# Altium schematic sheet Sensors.SchDoc
size A; SheetNumber: 3; SheetTotal: 3
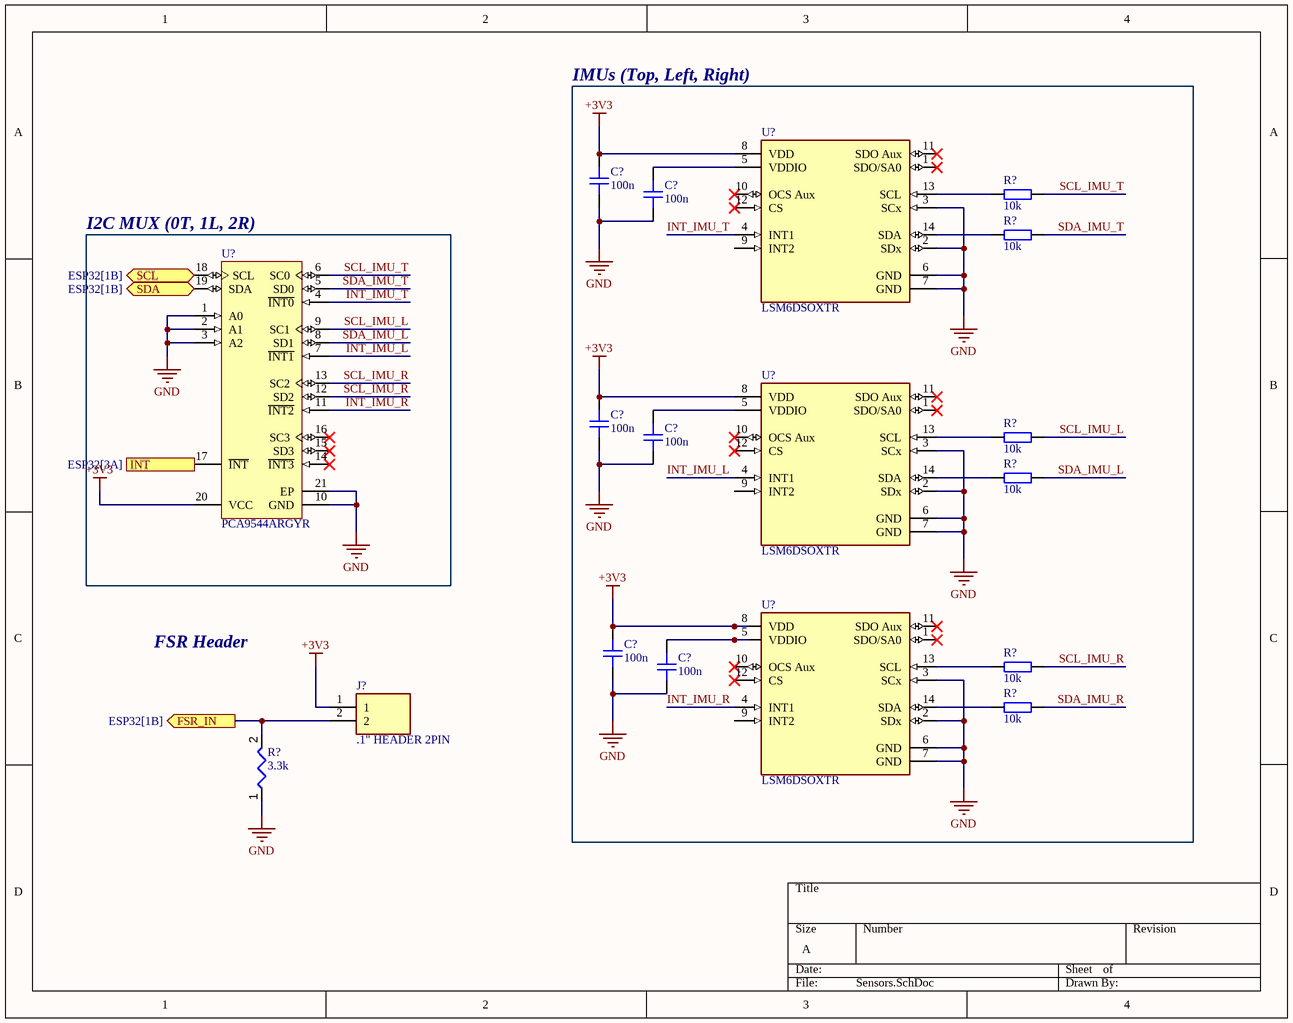
[diagram p0: Sensors.SchDoc]

## Parts
(Parts that share a designator on the sheet are numbered #1, #2 ... from top to bottom, then left to right.)
C?#1  100n  [CAP_0603]
C?#2  100n  [CAP_0603]
C?#3  100n  [CAP_0603]
C?#4  100n  [CAP_0603]
C?#5  100n  [CAP_0603]
C?#6  100n  [CAP_0603]
J?  .1" HEADER 2PIN  [HDRV2W64P0X254_1X2_508X250X850P]  (no BOM)
R?#1  10k  [RES_0603]
R?#2  10k  [RES_0603]
R?#3  10k  [RES_0603]
R?#4  10k  [RES_0603]
R?#5  10k  [RES_0603]
R?#6  10k  [RES_0603]
R?#7  value 3.3k  [RES_0603]  (hidden comment: RES 3.3k)
U?#1  LSM6DSOXTR  [FP-LGA-14L-DM00249496-MFG]
U?#2  PCA9544ARGYR  [RGY0020A_V]
U?#3  LSM6DSOXTR  [FP-LGA-14L-DM00249496-MFG]
U?#4  LSM6DSOXTR  [FP-LGA-14L-DM00249496-MFG]

## Blocks framed on the sheet
IMUs (Top, Left, Right): C?#1-C?#6 R?#1-R?#6 U?#1 U?#3 U?#4
I2C MUX (0T, 1L, 2R): U?#2

## Ports
FSR_IN (out, see ESP32[1B]), INT (out, see ESP32[3A]), SCL (bidir, see ESP32[1B]), SDA (bidir, see ESP32[1B])

## Nets
+3V3: C?#1.2 C?#3.2 C?#5.2 J?.1 U?#1.8(VDD) U?#2.20(VCC) U?#3.8(VDD) U?#4.8(VDD)
GND: C?#1.1 C?#2.1 C?#3.1 C?#4.1 C?#5.1 C?#6.1 R?#7.1 U?#1.2(SDx) U?#1.3(SCx) U?#1.6(GND) U?#1.7(GND) U?#2.1(A0) U?#2.2(A1) U?#2.3(A2) U?#2.10(GND) U?#2.21(EP) U?#3.2(SDx) U?#3.3(SCx) U?#3.6(GND) U?#3.7(GND) U?#4.2(SDx) U?#4.3(SCx) U?#4.6(GND) U?#4.7(GND)
FSR_IN: J?.2 R?#7.2 ; port FSR_IN
INT: U?#2.17(~{INT}) ; port INT
INT_IMU_L: U?#2.7(~{INT1}) U?#3.4(INT1)
INT_IMU_R: U?#2.11(~{INT2}) U?#4.4(INT1)
INT_IMU_T: U?#1.4(INT1) U?#2.4(~{INT0})
SCL: U?#2.18(SCL) ; port SCL
SCL_IMU_L: R?#3.2 U?#2.9(SC1)
SCL_IMU_R: R?#5.2 U?#2.12(SD2) U?#2.13(SC2)
SCL_IMU_T: R?#1.2 U?#2.6(SC0)
SDA: U?#2.19(SDA) ; port SDA
SDA_IMU_L: R?#4.2 U?#2.8(SD1)
SDA_IMU_R: R?#6.2
SDA_IMU_T: R?#2.2 U?#2.5(SD0)
NetC?#2_2: C?#2.2 U?#1.5(VDDIO)
NetC?#4_2: C?#4.2 U?#3.5(VDDIO)
NetC?#6_2: C?#6.2 U?#4.5(VDDIO)
NetR?#1_1: R?#1.1 U?#1.13(SCL)
NetR?#2_1: R?#2.1 U?#1.14(SDA)
NetR?#3_1: R?#3.1 U?#3.13(SCL)
NetR?#4_1: R?#4.1 U?#3.14(SDA)
NetR?#5_1: R?#5.1 U?#4.13(SCL)
NetR?#6_1: R?#6.1 U?#4.14(SDA)

Not connected (* = marked no-connect by the designer): U?#1 1(SDO/SA0)* 9(INT2) 10(OCS_Aux)* 11(SDO_Aux)* 12(CS)*; U?#2 14(~{INT3})* 15(SD3)* 16(SC3)*; U?#3 1(SDO/SA0)* 9(INT2) 10(OCS_Aux)* 11(SDO_Aux)* 12(CS)*; U?#4 1(SDO/SA0)* 9(INT2) 10(OCS_Aux)* 11(SDO_Aux)* 12(CS)*

## Notes on the sheet
- FSR Header

## Library data of the parts
C?#1-C?#6 = CAP_0603: Capacitor SMD 0603; Manufacturer: *; Manufacturer Part Number: *; Distributor Link: *; LCSC: *; Rating: *; Dielectric: *
J? = CMP-002-00117-1: Connector; Source: SamacSys.SchLib; Design Item ID: .1" HEADER 2PIN
R?#1-R?#6 = RES_0603: Resistor SMD 0603; Manufacturer: *; Manufacturer Part Number: *; Distributor Link: *; LCSC: *
R?#7 = CMP-009-01777-1: Resistor 3.3k 5% 100 mW 0603; Power: 100mW; Design Item ID: RES 3.3k; Source: Generic_Schematic_Library.SchLib; Tolerance: 5%
U?#1 U?#3 U?#4 = CMP-12177-000010-1: INEMO INERTIAL MODULE: 3D ACCELE; Manufacturer: STMicroelectronics; Sensor Type: Temperature,Accelerometer,Gyroscope; Accel Range: 2/4/8/16g; Accel Sensitivity: 0.061/0.122/0.244/0.488mV/g; Operating Supply Current: 0.55mA; Gyro Range: 125/250/500/1000/2000°/s; Gyro Sensitivity: 4.375/8.75/17.5/35/70LSB/°/s; Sensor Output: I2C,SPI,Other; Min Supply Voltage: 1.62V; Max Supply Voltage: 3.6V; Octopart: https://octopart.com/lsm6dsoxtr-stmicroelectronics-98102600; Package: LGA-14L-DM00249496; Footprint Url: https://www.st.com/content/ccc/resource/technical/document/technical_note/73/17/9c/16/dd/96/4a/01/CD00134799.pdf/files/CD00134799.pdf/jcr:content/translations/en.CD00134799.pdf; ComponentLink2Description: Datasheet; Mouser Description: LSM6DSOX: 3.6 V 3 Axis Accelerometer Gyroscope iNEMO Inertial Module - LGA-14L; ComponentLink2URL: https://www.st.com/resource/en/datasheet/lsm6dsox.pdf; Temperature Range Low: -40°C; Digikey Description: INEMO INERTIAL MODULE: 3D ACCELE; Lead Free: Yes; Device Class L3: Inertial Measurement Units (IMUs); Category: IC; Device Class L2: Motion Sensors; RoHS: TRUE; Temperature: -40°C to +85°C; Height: 0.86mm; Device Class L1: Sensors; Temperature Range High: +85°C; Manufacturer Part Number: LSM6DSOXTR; Automotive: No
U?#2 = CMP-0314-00024-2: 4-Channel I2C and SMBus Multiplexer with Interrupt Logic, 2.3 to 5.5 V, -40 to 85 degC, 20-pin VQFN (RGY), Green (RoHS & no Sb/Br); Manufacturer: Texas Instruments; I2C Address: 1110 xxx; Interrupt Output: Yes; tpd max(ns): 0.3, 1; SubFamily: I2C Multiplexer, Switch; Max Frequency(kHz): 400; VCC(Min)(V): 2.3; Simultaneously Active Channels: 1; Channel Width: 4; VCC(Max)(V): 5.5; fSCLK(Max)(MHz): 0.1, 0.4; ComponentLink2Description: Package Specification; PackageDescription: 20-Leads Plastic Quad Flatpack No-Lead, 3.5 x 4.5 x 0.9 mm Body, 0.5 mm Pitch; Vcc range(V): 2.3 to 5.5; ComponentLink2URL: http://www.ti.com/litv/pdf/mpds006c; DatasheetVersion: SCPS146D; Mounting Technology: Surface Mount; Eco-Plan: Green (RoHS & no Sb/Br); ComponentLink1URL: http://www.ti.com/general/docs/lit/getliterature.tsp?genericPartNumber=PCA9544A&fileType=pdf; PackageReference: RGY0020A; 5V Tolerant I/O: Yes; Code_JEDEC: MO-241-BA; PartNumber: PCA9544ARGYR; Open Drain I/O Type: Yes; ComponentLink1Description: Datasheet; PackageVersion: revI, Jun-2011